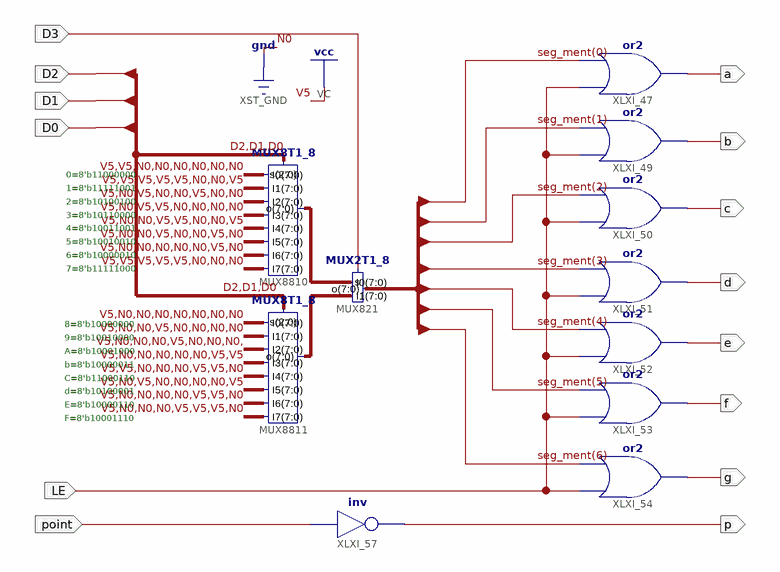
[diagram p0: schematic sheet 1]
// Xilinx ISE schematic MY14495.sch (kintex7) as structural Verilog: 11 symbols, 14 ports
module MY14495 (
  input  D3,
  input  D1,
  input  D0,
  input  D2,
  input  LE,
  input  point,
  output c,
  output b,
  output a,
  output d,
  output g,
  output f,
  output e,
  output p
);

  wire [7:0] seg_ment, seglow, segup;

  MUX8T1_8 MUX8810 (
    .s({D2, D1, D0}), .I7(8'b11111000), .I6(8'b10000010), .I5(8'b10010010), .I4(8'b10011001),
    .I3(8'b10110000), .I2(8'b10100100), .I1(8'b11111001), .I0(8'b11000000), .o(seglow));
  MUX8T1_8 MUX8811 (
    .s({D2, D1, D0}), .I7(8'b10001110), .I6(8'b10000110), .I5(8'b10100001), .I4(8'b11000110),
    .I3(8'b10000011), .I2(8'b10001000), .I1(8'b10010000), .I0(8'b10000000), .o(segup));
  MUX2T1_8 MUX821 (.I1(segup), .I0(seglow), .o(seg_ment), .s(D3));
  or XLXI_51 (d, LE, seg_ment[3]);
  or XLXI_50 (c, LE, seg_ment[2]);
  or XLXI_49 (b, LE, seg_ment[1]);
  or XLXI_47 (a, LE, seg_ment[0]);
  or XLXI_52 (e, LE, seg_ment[4]);
  or XLXI_54 (g, LE, seg_ment[6]);
  or XLXI_53 (f, LE, seg_ment[5]);
  not XLXI_57 (p, point);

  // Notes on the sheet:
  //   0=8'b11000000
  //   1=8'b11111001
  //   2=8'b10100100
  //   3=8'b10110000
  //   4=8'b10011001
  //   5=8'b10010010
  //   6=8'b10000010
  //   7=8'b11111000
  //   8=8'b10000000
  //   9=8'b10010000
  //   A=8'b10001000
  //   b=8'b10000011
  //   C=8'b11000110
  //   d=8'b10100001
  //   E=8'b10000110
  //   F=8'b10001110
endmodule
